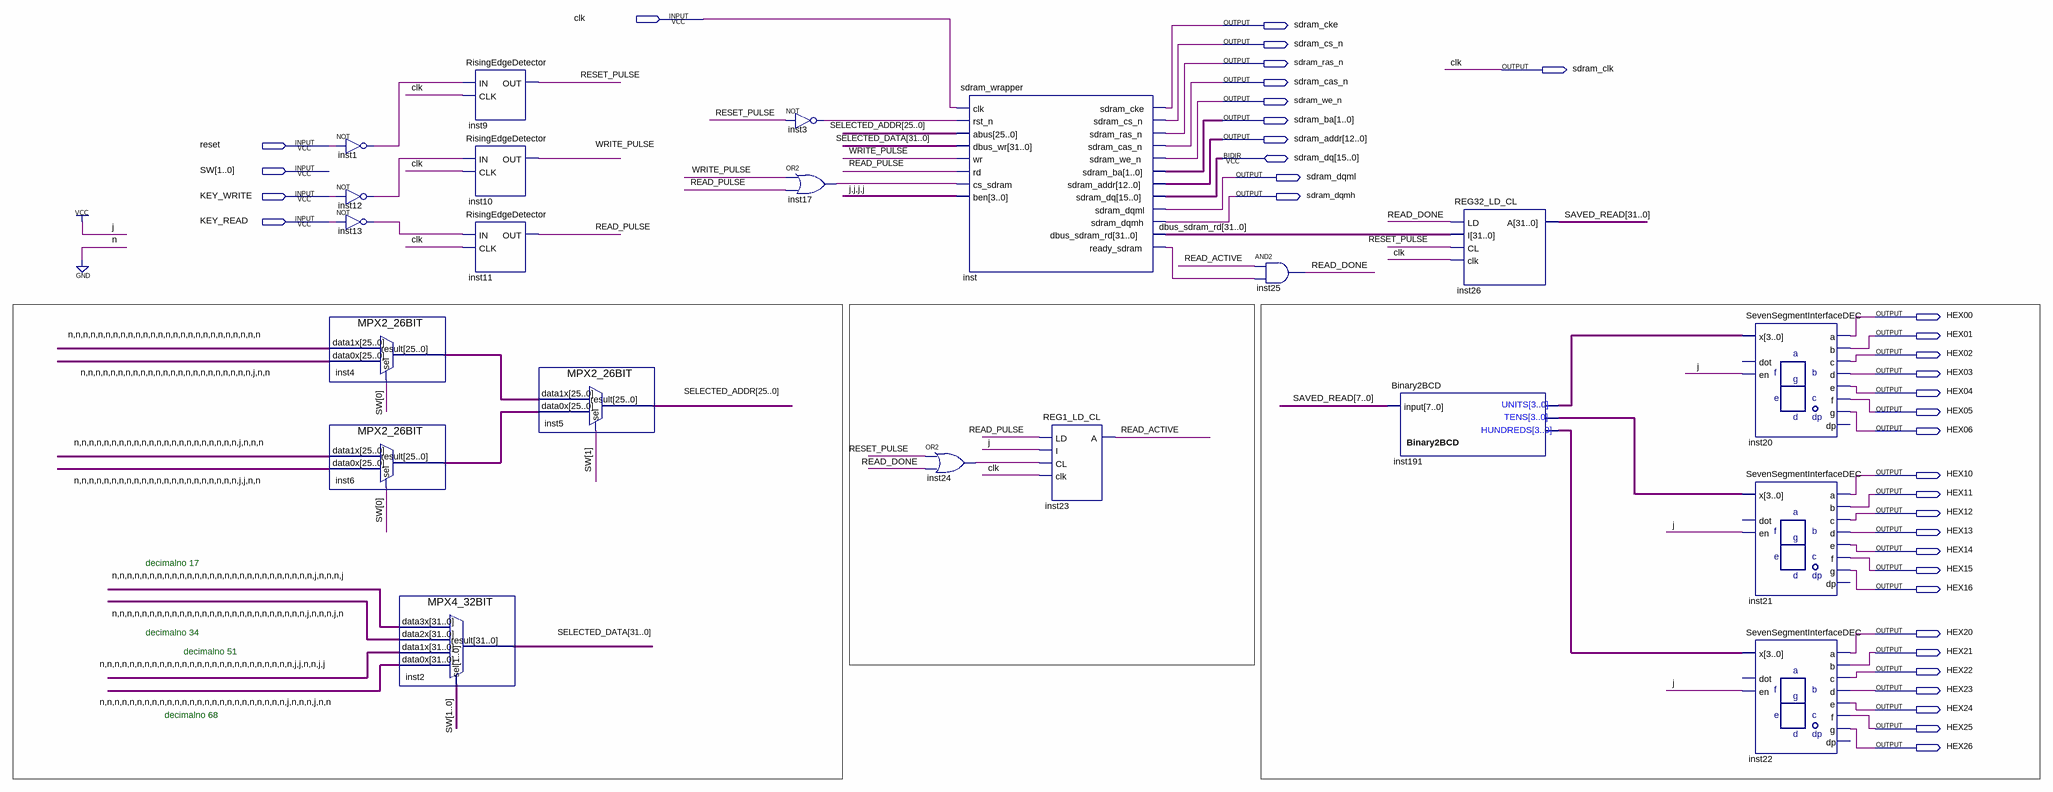
[diagram p0: schematic sheet]
// Quartus schematic SDRAM_TEST.bdf as structural Verilog: 21 symbols, 37 pins
module SDRAM_TEST (
  input  clk,
  input  reset,
  input  [1:0] SW,
  input  KEY_WRITE,
  input  KEY_READ,
  inout  [15:0] sdram_dq,
  output sdram_cke,
  output sdram_cs_n,
  output sdram_ras_n,
  output sdram_clk,
  output sdram_cas_n,
  output sdram_we_n,
  output [1:0] sdram_ba,
  output [12:0] sdram_addr,
  output sdram_dqml,
  output sdram_dqmh,
  output HEX00,
  output HEX01,
  output HEX02,
  output HEX03,
  output HEX04,
  output HEX05,
  output HEX06,
  output HEX10,
  output HEX11,
  output HEX12,
  output HEX13,
  output HEX14,
  output HEX15,
  output HEX16,
  output HEX20,
  output HEX21,
  output HEX22,
  output HEX23,
  output HEX24,
  output HEX25,
  output HEX26
);

  wire inst1_out, inst3_out, inst13_out, inst17_out, inst24_out, inst_ready_sdram, READ_ACTIVE, READ_DONE,
       READ_PULSE, RESET_PULSE, WRITE_PULSE;
  wire [3:0] inst191_bcd_hundreds, inst191_bcd_tens, inst191_bcd_units;
  wire [25:0] inst4_result, inst6_result, SELECTED_ADDR;
  wire [31:0] dbus_sdram_rd, SAVED_READ, SELECTED_DATA;

  not inst1 (inst1_out, reset);
  not inst12 (KEY_WRITE, KEY_WRITE);
  not inst13 (inst13_out, KEY_READ);
  MPX2_26BIT inst4 (.data1x({26{1'b0}}), .data0x(26'b00000000000000000000000100), .sel(SW[0]), .result(inst4_result));
  MPX2_26BIT inst6 (
    .data1x(26'b00000000000000000000001000), .data0x(26'b00000000000000000000001100), .sel(SW[0]),
    .result(inst6_result));
  MPX4_32BIT inst2 (
    .data3x(32'b00000000000000000000000000010001), .data2x(32'b00000000000000000000000000100010),
    .data1x(32'b00000000000000000000000000110011), .data0x(32'b00000000000000000000000001000100), .sel(SW),
    .result(SELECTED_DATA));
  RisingEdgeDetector inst9 (.IN(inst1_out), .CLK(clk), .OUT(RESET_PULSE));
  RisingEdgeDetector inst10 (.IN(KEY_WRITE), .CLK(clk), .OUT(WRITE_PULSE));
  RisingEdgeDetector inst11 (.IN(inst13_out), .CLK(clk), .OUT(READ_PULSE));
  MPX2_26BIT inst5 (.data1x(inst4_result), .data0x(inst6_result), .sel(SW[1]), .result(SELECTED_ADDR));
  not inst3 (inst3_out, RESET_PULSE);
  or inst17 (inst17_out, WRITE_PULSE, READ_PULSE);
  or inst24 (inst24_out, RESET_PULSE, READ_DONE);
  sdram_wrapper inst (
    .clk(clk), .rst_n(inst3_out), .abus(SELECTED_ADDR), .dbus_wr(SELECTED_DATA), .wr(WRITE_PULSE),
    .rd(READ_PULSE), .cs_sdram(inst17_out), .ben(4'b1111), .sdram_cke(sdram_cke), .sdram_cs_n(sdram_cs_n),
    .sdram_ras_n(sdram_ras_n), .sdram_cas_n(sdram_cas_n), .sdram_we_n(sdram_we_n), .sdram_ba(sdram_ba),
    .sdram_addr(sdram_addr), .sdram_dqml(sdram_dqml), .sdram_dqmh(sdram_dqmh), .dbus_sdram_rd(dbus_sdram_rd),
    .ready_sdram(inst_ready_sdram), .sdram_dq(sdram_dq));
  REG1_LD_CL inst23 (.LD(READ_PULSE), .I(1'b1), .CL(inst24_out), .clk(clk), .A(READ_ACTIVE));
  and inst25 (READ_DONE, READ_ACTIVE, inst_ready_sdram);
  Binary2BCD inst191 (
    .\input (SAVED_READ[7:0]), .bcd_hundreds(inst191_bcd_hundreds), .bcd_tens(inst191_bcd_tens),
    .bcd_units(inst191_bcd_units));
  REG32_LD_CL inst26 (.LD(READ_DONE), .I(dbus_sdram_rd), .CL(RESET_PULSE), .clk(clk), .A(SAVED_READ));
  SevenSegmentInterfaceDEC inst20 (
    .en(1'b1), .x(inst191_bcd_units), .a(HEX00), .b(HEX01), .c(HEX02), .d(HEX03), .e(HEX04), .f(HEX05),
    .g(HEX06));  // open: dot, dp
  SevenSegmentInterfaceDEC inst21 (
    .en(1'b1), .x(inst191_bcd_tens), .a(HEX10), .b(HEX11), .c(HEX12), .d(HEX13), .e(HEX14), .f(HEX15),
    .g(HEX16));  // open: dot, dp
  SevenSegmentInterfaceDEC inst22 (
    .en(1'b1), .x(inst191_bcd_hundreds), .a(HEX20), .b(HEX21), .c(HEX22), .d(HEX23), .e(HEX24), .f(HEX25),
    .g(HEX26));  // open: dot, dp

  assign sdram_clk = clk;

  // Notes on the sheet:
  //   decimalno 17
  //   decimalno 34
  //   decimalno 51
  //   decimalno 68
endmodule
